# EasyEDA schematic six max uno_2021-06-03.json
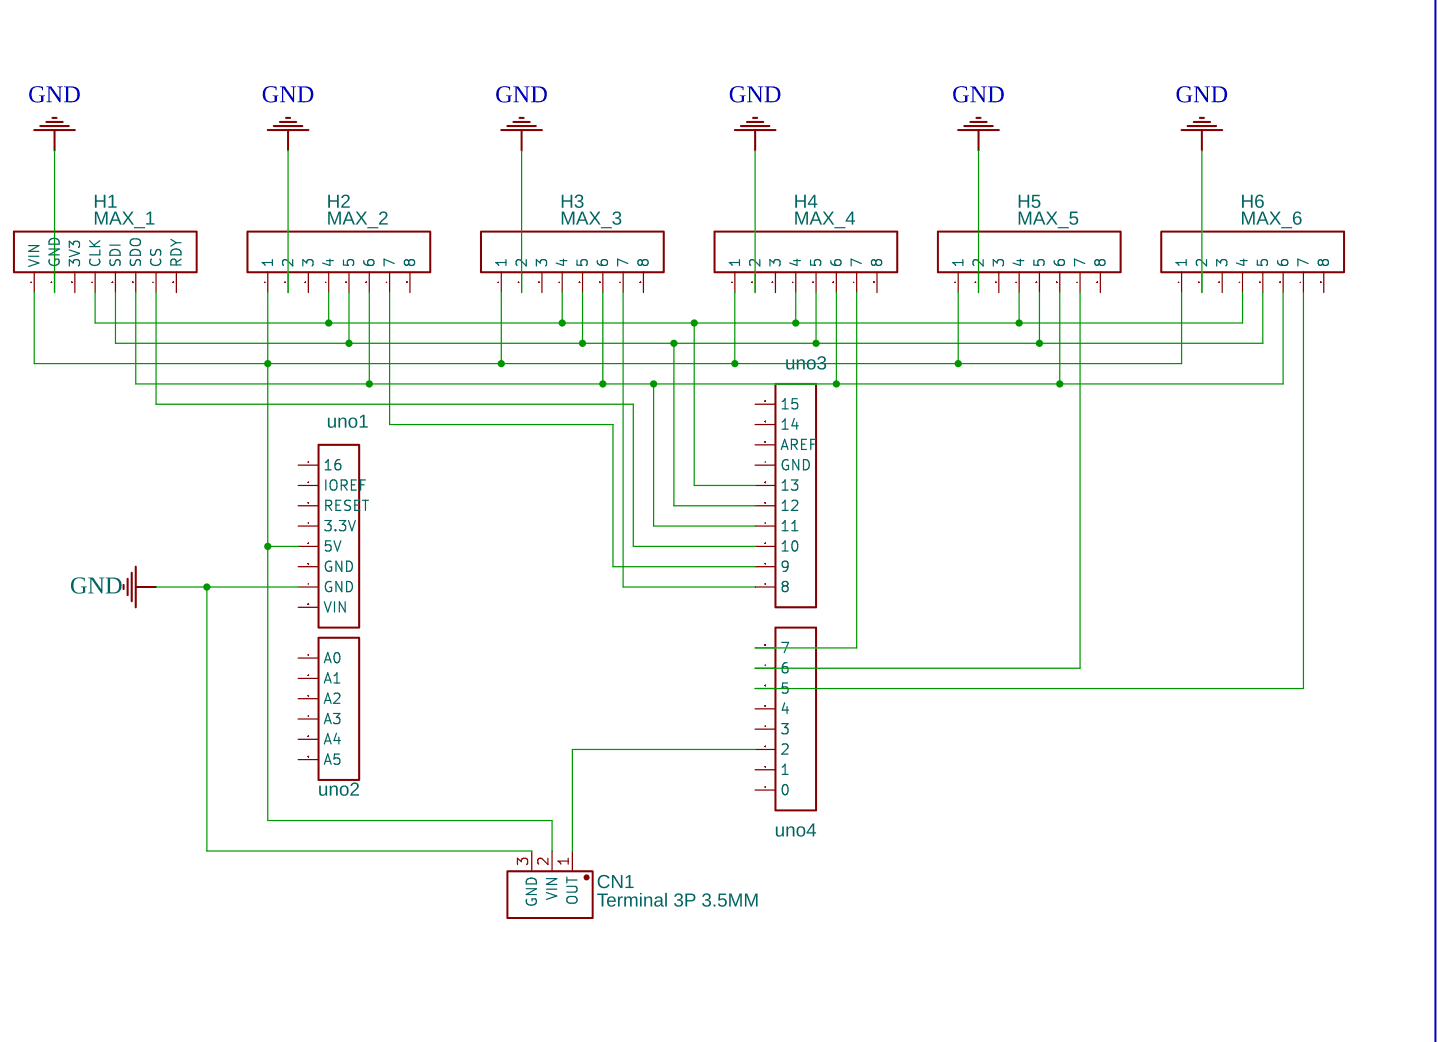
[diagram p0: schematic sheet]

## Parts
CN1  Terminal 3P 3.5MM  [TERMINAL 1X3P 3.5MM]
H1  MAX_1  [HDR-F-2.54_1X8]
H2  MAX_2  [HDR-F-2.54_1X8]
H3  MAX_3  [HDR-F-2.54_1X8]
H4  MAX_4  [HDR-F-2.54_1X8]
H5  MAX_5  [HDR-F-2.54_1X8]
H6  MAX_6  [HDR-F-2.54_1X8]
J1  uno4  [HDR-M-2.54_1X8]
J2  uno1  [HDR-M-2.54_1X8]
J3  uno3  [HDR-M-2.54_1X10]
J4  uno2  [HDR-M-2.54_1X6]

## Library data of the parts
CN1 = Terminal 3P 3.5MM: Supplier: LCSC; Manufacturer: METZ CONNECT; Manufacturer Part: 31524103; Contributor: LCSC; Supplier Part: C123243
H1-H6 = HDR-F-2.54_1x8: Supplier Part: C225505; Supplier: LCSC; Contributor: LCEDA_Lib
J1 J2 = HDR-M-2.54_1x8: Supplier Part: C190820; Supplier: LCSC; Contributor: LCEDA_Lib
J3 = HDR-M-2.54_1x10: Supplier Part: C57369; Supplier: LCSC; Contributor: LCEDA_Lib
J4 = HDR-M-2.54_1x6: Supplier Part: C190819; Supplier: LCSC; Contributor: LCEDA_Lib

## Nets
GND: CN1.3(GND) H1.2(GND) H2.2 H3.2 H4.2 H5.2 H6.2 J2.7(GND)
Net-(CN1-1): CN1.1(OUT) J1.3(2)
Net-(CN1-2): CN1.2(VIN) H1.1(VIN) H2.1 H3.1 H4.1 H5.1 H6.1 J2.5(5V)
Net-(H1-4): H1.4(CLK) H2.4 H3.4 H4.4 H5.4 H6.4 J3.6(13)
Net-(H1-5): H1.5(SDI) H2.5 H3.5 H4.5 H5.5 H6.5 J3.5(12)
Net-(H1-6): H1.6(SDO) H2.6 H3.6 H4.6 H5.6 H6.6 J3.4(11)
Net-(H1-7): H1.7(CS) J3.3(10)
Net-(H2-7): H2.7 J3.2(9)
Net-(H3-7): H3.7 J3.1(8)
Net-(H4-7): H4.7 J1.8(7)
Net-(H5-7): H5.7 J1.7(6)
Net-(H6-7): H6.7 J1.6(5)

Not connected (* = marked no-connect by the designer): H1 3(3V3) 8(RDY); H2 3 8; H3 3 8; H4 3 8; H5 3 8; H6 3 8; J1 1(0) 2(1) 4(3) 5(4); J2 1(16) 2(IOREF) 3(RESET) 4(3.3V) 6(GND) 8(VIN); J3 7(GND) 8(AREF) 9(14) 10(15); J4 1(A0) 2(A1) 3(A2) 4(A3) 5(A4) 6(A5)
